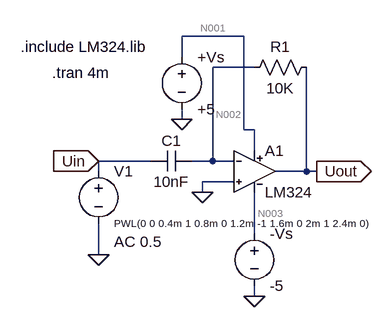
[diagram p0: schematic 3_b.asc]
3_b.asc, the LTspice schematic file:
Version 4.1
SHEET 1 880 680
WIRE 304 -64 208 -64
WIRE 208 -32 208 -64
WIRE 320 -16 256 -16
WIRE 208 64 208 48
WIRE 304 80 304 -64
WIRE 320 80 304 80
WIRE 320 112 320 80
WIRE 160 128 80 128
WIRE 256 128 256 -16
WIRE 256 128 224 128
WIRE 288 128 256 128
WIRE 80 144 80 128
WIRE 400 144 400 -16
WIRE 400 144 352 144
WIRE 416 144 400 144
WIRE 288 160 240 160
WIRE 240 176 240 160
WIRE 320 240 320 176
WIRE 80 272 80 224
WIRE 320 336 320 320
FLAG 240 176 0
FLAG 208 64 0
FLAG 320 336 0
FLAG 80 128 Uin
IOPIN 80 128 In
FLAG 416 144 Uout
IOPIN 416 144 Out
FLAG 80 272 0
SYMBOL LM324 320 144 R0
SYMATTR InstName Α1
SYMBOL res 416 -32 R90
WINDOW 0 0 56 VBottom 2
WINDOW 3 32 56 VTop 2
SYMATTR InstName R1
SYMATTR Value 10K
SYMATTR SpiceLine tol=1 pwr=0.1
SYMBOL voltage 208 -48 R0
WINDOW 123 0 0 Left 0
WINDOW 39 0 0 Left 0
SYMATTR InstName +Vs
SYMATTR Value +5
SYMBOL voltage 320 224 R0
WINDOW 123 0 0 Left 0
WINDOW 39 0 0 Left 0
SYMATTR InstName -Vs
SYMATTR Value -5
SYMBOL voltage 80 128 R0
WINDOW 123 24 124 Left 2
WINDOW 39 0 0 Left 0
WINDOW 3 24 96 Left 1
SYMATTR Value2 AC 0.5
SYMATTR Value PWL(0 0 0.4m 1 0.8m 0 1.2m -1 1.6m 0 2m 1 2.4m 0)
SYMATTR InstName V1
SYMBOL cap 224 112 R90
WINDOW 0 0 32 VBottom 2
WINDOW 3 32 32 VTop 2
SYMATTR InstName C1
SYMATTR Value 10nF
TEXT -40 -48 Left 2 !.include LM324.lib
TEXT 8 -8 Left 2 !.tran 4m

The netlist it stands for:
* 3_b.asc
X§Α1 0 N002 N001 N003 Uout LM324  ; pins In+ In- V+ V- OUT
R1 Uout N002 10K tol=1 pwr=0.1
V§+Vs N001 0 +5
V§-Vs N003 0 -5
V1 Uin 0 PWL(0 0 0.4m 1 0.8m 0 1.2m -1 1.6m 0 2m 1 2.4m 0) AC 0.5
C1 N002 Uin 10nF
.include LM324.lib
.tran 4m
.backanno
.end

* Results of the author's LTspice run, read from the files saved beside the schematic
* Operating Point, zero values left out:
*   V(n001) = 5 V
*   V(uout) = -588.4 µV
*   V(n002) = -88.4 µV
*   V(n003) = -5 V
*   I(+Vs) = -357.6 µA
*   I(R1) = -50 nA
*   I(-Vs) = 357.6 µA
*   Ix(α1:in+) = -48.56 nA
*   Ix(α1:in-) = -50 nA
*   Ix(α1:vcc) = 357.6 µA
*   Ix(α1:vss) = -357.6 µA
*   Ix(α1:out) = 50 nA
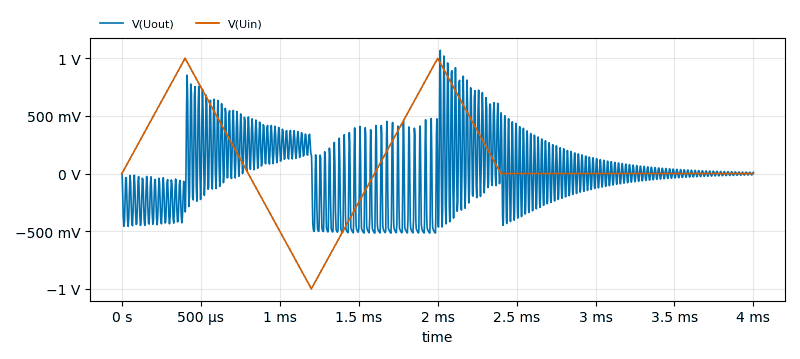
[diagram p1: Transient Analysis of 3_b.asc, plotted from the saved traces]
* Transient Analysis, 1 run:
*   V(Uout): min -517 mV, max 1.069 V, average -622.5 µV, rms 305.5 mV, last 10.62 mV
*   V(Uin): min -1 V, max 1 V, average 100 mV, rms 447.2 mV, last 0 V